# EAGLE design Arduino_MEGA_home_HVAC v2.0 (EAGLE 7.1.0)
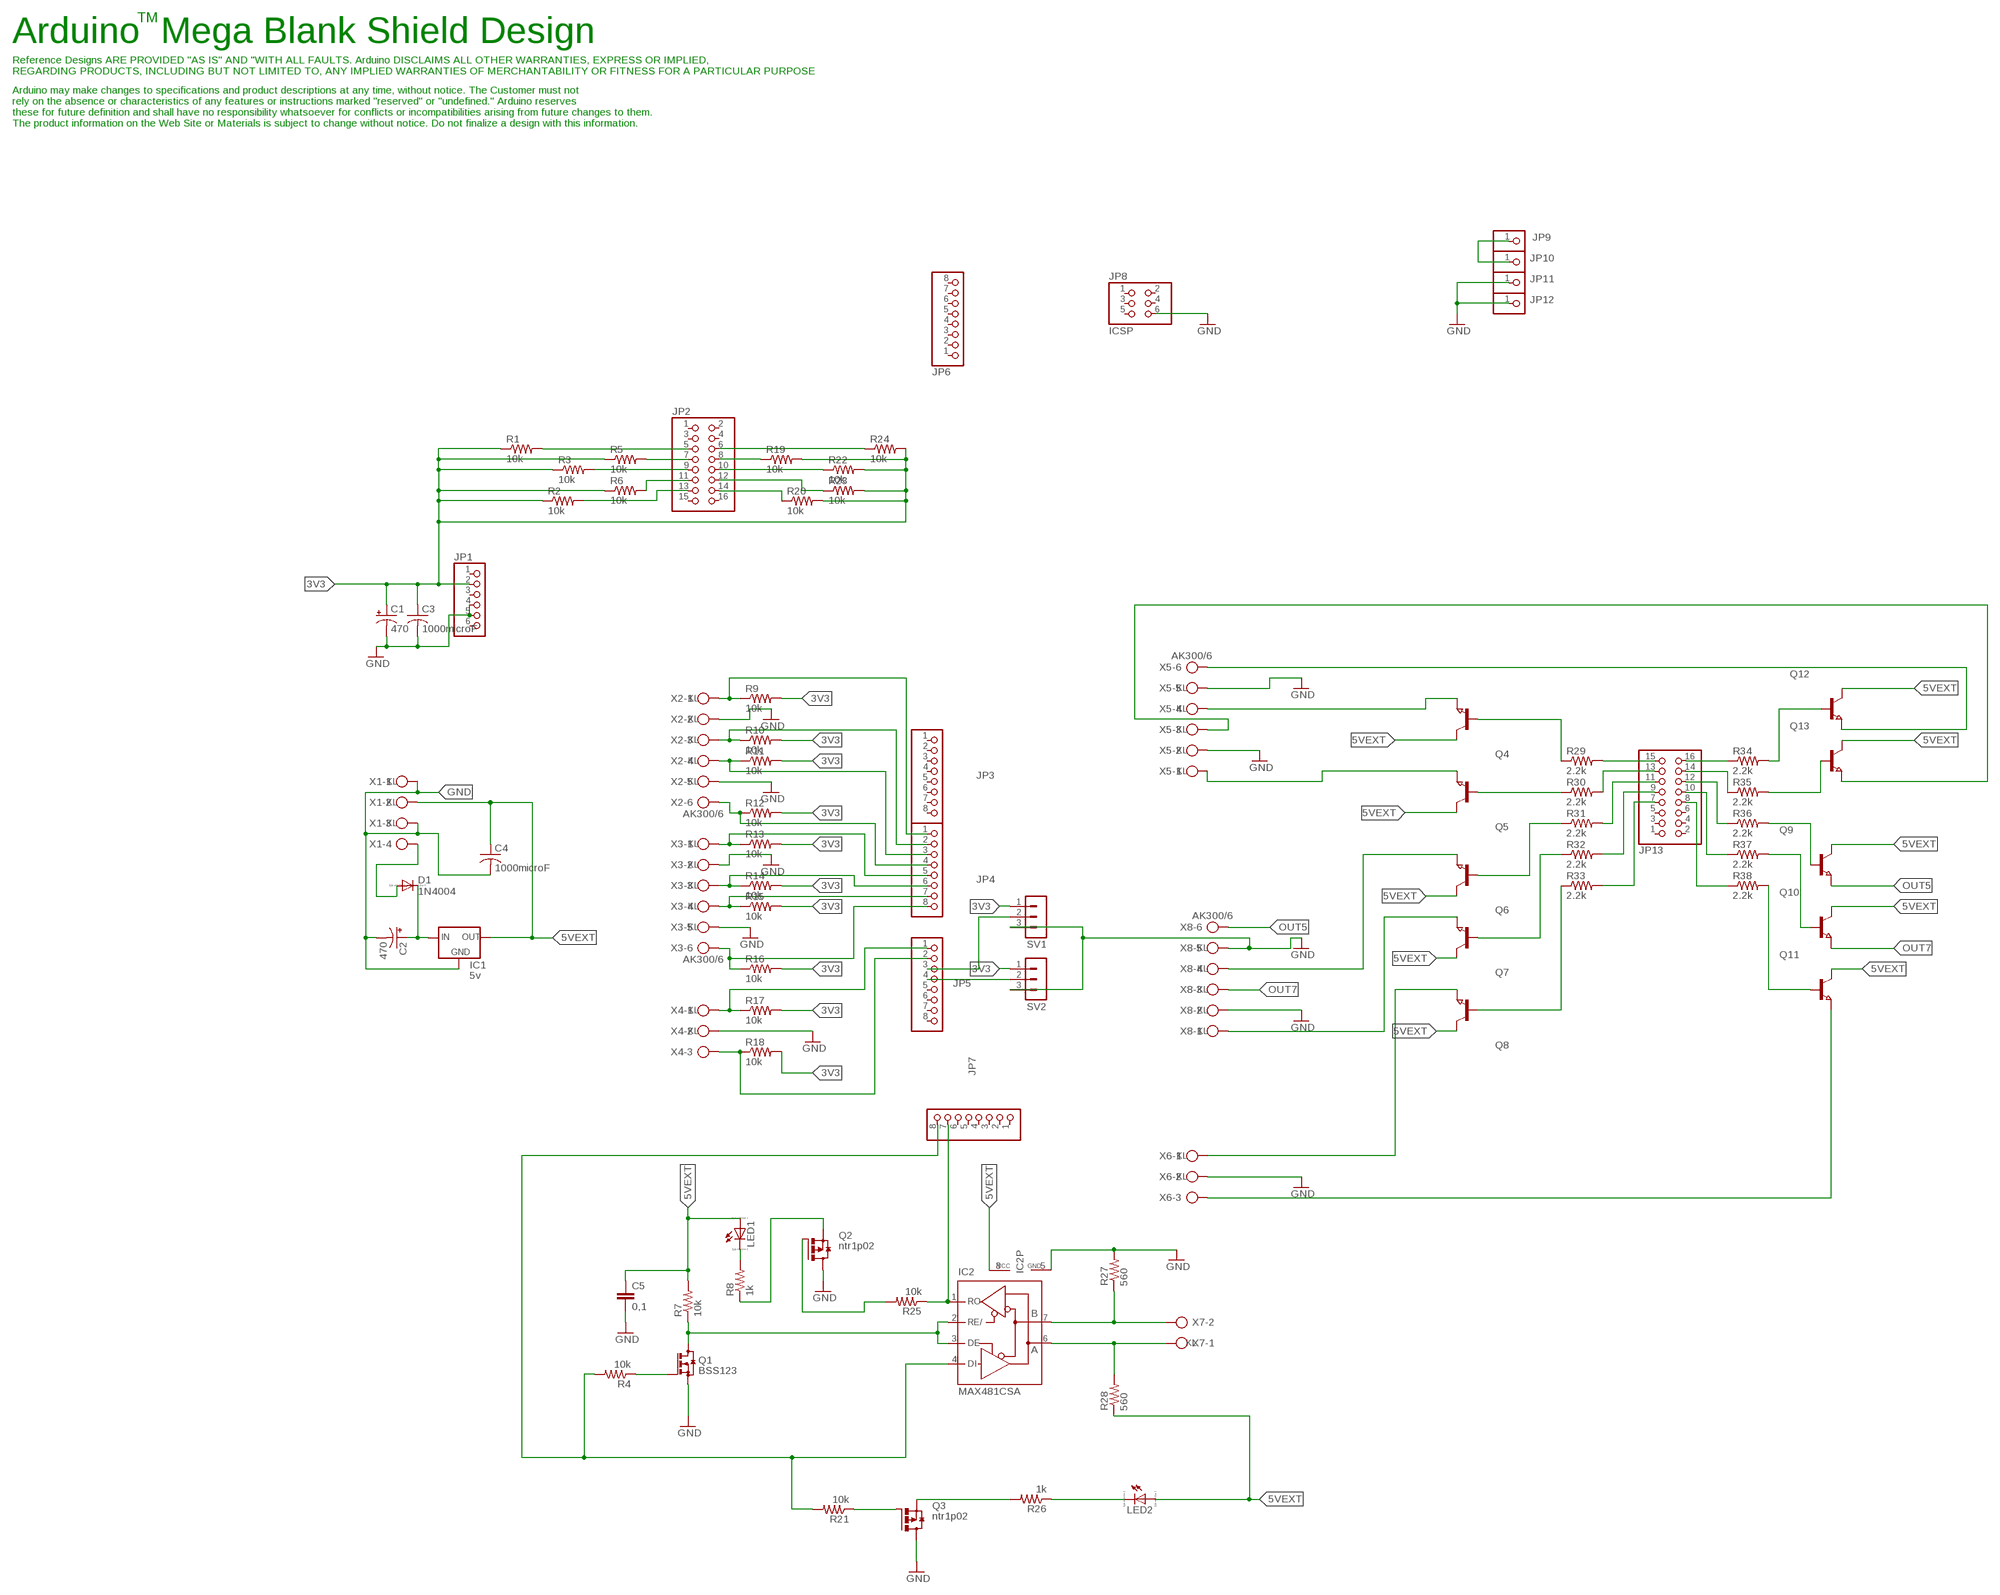
[diagram p0: schematic, sheet 1]

## Parts
C1  470  CPOL-USE5-6  [E5-6]
C2  470  CPOL-USE5-6  [E5-6]
C3  1000microF  C-US025-040X050  [C025-040X050]
C4  1000microF  C-US025-040X050  [C025-040X050]
C5  0,1  C2.5/2  [C2.5-2]
D1  1N4004  [DO41-10]
IC1  5v  78MXXL  [78MXXL]
IC2  MAX481CSA  [SO08]
JP1  PINHD-1X6  [1X06]
JP2  PINHD-2X8  [2X08]
JP3  PINHD-1X8  [1X08]
JP4  PINHD-1X8  [1X08]
JP5  PINHD-1X8  [1X08]
JP6  PINHD-1X8  [1X08]
JP7  PINHD-1X8  [1X08]
JP8  ICSP  PINHD-2X3  [2X03]
JP9  PINHD-1X1  [1X01]
JP10  PINHD-1X1  [1X01]
JP11  PINHD-1X1  [1X01]
JP12  PINHD-1X1  [1X01]
JP13  PINHD-2X8  [2X08]
LED1  LED_E  [LED_1206]
LED2  LED_E  [LED_1206]
Q1  BSS123  [SOT23]
Q2  ntr1p02  FDN360P  [SUPER-SOT3]
Q3  ntr1p02  FDN360P  [SUPER-SOT3]
Q4  NPN-TRANSISTOR_SOT23  [SOT23]
Q5  NPN-TRANSISTOR_SOT23  [SOT23]
Q6  NPN-TRANSISTOR_SOT23  [SOT23]
Q7  NPN-TRANSISTOR_SOT23  [SOT23]
Q8  NPN-TRANSISTOR_SOT23  [SOT23]
Q9  NPN-TRANSISTOR_SOT23  [SOT23]
Q10  NPN-TRANSISTOR_SOT23  [SOT23]
Q11  NPN-TRANSISTOR_SOT23  [SOT23]
Q12  NPN-TRANSISTOR_SOT23  [SOT23]
Q13  NPN-TRANSISTOR_SOT23  [SOT23]
R1  10k  R-US_R0805  [R0805]
R2  10k  R-US_R0805  [R0805]
R3  10k  R-US_R0805  [R0805]
R4  10k  R-US_R0805  [R0805]
R5  10k  R-US_R0805  [R0805]
R6  10k  R-US_R0805  [R0805]
R7  10k  R-US_R0805  [R0805]
R8  1k  R-US_R0805  [R0805]
R9  10k  R-US_R0805  [R0805]
R10  10k  R-US_R0805  [R0805]
R11  10k  R-US_R0805  [R0805]
R12  10k  R-US_R0805  [R0805]
R13  10k  R-US_R0805  [R0805]
R14  10k  R-US_R0805  [R0805]
R15  10k  R-US_R0805  [R0805]
R16  10k  R-US_R0805  [R0805]
R17  10k  R-US_R0805  [R0805]
R18  10k  R-US_R0805  [R0805]
R19  10k  R-US_R0805  [R0805]
R20  10k  R-US_R0805  [R0805]
R21  10k  R-US_R0805  [R0805]
R22  10k  R-US_R0805  [R0805]
R23  10k  R-US_R0805  [R0805]
R24  10k  R-US_R0805  [R0805]
R25  10k  R-US_R0805  [R0805]
R26  1k  R-US_R0805  [R0805]
R27  560  R-US_R0805  [R0805]
R28  560  R-US_R0805  [R0805]
R29  2.2k  R-US_M0805  [M0805]
R30  2.2k  R-US_M0805  [M0805]
R31  2.2k  R-US_M0805  [M0805]
R32  2.2k  R-US_M0805  [M0805]
R33  2.2k  R-US_M0805  [M0805]
R34  2.2k  R-US_M0805  [M0805]
R35  2.2k  R-US_M0805  [M0805]
R36  2.2k  R-US_M0805  [M0805]
R37  2.2k  R-US_M0805  [M0805]
R38  2.2k  R-US_M0805  [M0805]
SV1  MA03-1  [MA03-1]
SV2  MA03-1  [MA03-1]
X1  AK500/4  [AK500/4]
X2  AK300/6  [AK300/6]
X3  AK300/6  [AK300/6]
X4  AK300/3  [AK300/3]
X5  AK300/6  [AK300/6]
X6  AK300/3  [AK300/3]
X7  AK300/2  [AK300/2]
X8  AK300/6  [AK300/6]

## Nets
3V3: C1.+ C3.1 JP1.2 R1.1 R2.1 R3.1 R5.1 R6.1 R9.2 R10.2 R11.2 R12.2 R13.2 R14.2 R15.2 R16.2 R17.2 R18.2 R19.2 R20.2 R22.2 R23.2 R24.2 SV1.1 SV2.1
5VEXT: C4.1 C5.1 IC1.OUT IC2.8(VCC) LED1.A LED2.A Q4.3(C) Q5.3(C) Q6.3(C) Q7.3(C) Q8.3(C) Q9.3(C) Q10.3(C) Q11.3(C) Q12.3(C) Q13.3(C) R7.2 R28.1 X1.2
COM3RX: IC2.1(RO) JP7.7 R25.1
COM3TX: IC2.4(DI) JP7.8 R4.2 R21.2
GND: C1.- C2.- C3.2 C4.2 C5.2 IC1.GND IC2.5(GND) JP1.4 JP1.5 JP8.6 JP11.1 JP12.1 Q1.2(S) Q2.3(D) Q3.3(D) R27.2 SV1.3 SV2.3 X1.1 X1.3 X2.2 X2.5 X3.2 X3.5 X4.2 X5.2 X5.5 X6.2 X8.2 X8.5
N$1: JP4.8 R16.1 X3.6
N$2: JP4.7 R15.1 X3.4
N$3: JP4.6 R14.1 X3.3
N$4: JP4.5 R13.1 X3.1
N$5: JP4.1 R9.1 X2.1
N$6: JP5.1 R17.1 X4.1
N$7: JP4.3 R11.1 X2.4
N$8: JP4.4 R12.1 X2.6
N$9: JP5.2 R18.1 X4.3
N$10: JP4.2 R10.1 X2.3
N$11: JP13.15 R29.2
N$12: JP13.16 R34.1
N$13: JP13.14 R35.1
N$14: JP13.12 R36.1
N$15: JP13.10 R37.1
N$16: JP13.13 R30.2
N$17: JP13.11 R31.2
N$18: JP13.9 R32.2
N$19: JP13.8 R38.1
N$20: JP13.7 R33.2
N$21: Q4.1(B) R29.1
N$22: Q12.1(B) R34.2
N$23: Q5.1(B) R30.1
N$24: Q13.1(B) R35.2
N$25: Q4.2(E) X5.4
N$26: Q5.2(E) X5.1
N$27: Q13.2(E) X5.3
N$28: Q6.1(B) R31.1
N$29: Q6.2(E) X8.4
N$30: Q9.1(B) R36.2
N$31: Q7.1(B) R32.1
N$32: Q10.1(B) R37.2
N$33: Q8.2(E) X6.1
N$34: Q11.2(E) X6.3
N$35: Q7.2(E) X8.1
N$36: JP9.1 JP10.1
N$37: Q11.1(B) R38.2
N$38: Q8.1(B) R33.1
N$39: Q12.2(E) X5.6
N$40: JP2.12 R23.1
N$41: D1.A X1.4
N$42: C2.+ D1.C IC1.IN
N$43: JP5.3 SV1.2
N$44: JP5.4 SV2.2
N$45: IC2.2(RE/) IC2.3(DE) Q1.3(D) R7.1
N$46: LED1.C R8.2
N$47: Q1.1(G) R4.1
N$48: Q2.2(S) R8.1
N$49: JP2.14 R20.1
N$50: JP2.11 R6.2
N$51: JP2.13 R2.2
N$52: IC2.7(B) R27.1 X7.2
N$53: JP2.6 R24.1
N$54: JP2.5 R1.2
N$55: JP2.7 R5.2
N$56: JP2.8 R19.1
N$57: JP2.10 R22.1
N$58: JP2.9 R3.2
N$59: IC2.6(A) R28.2 X7.1
N$60: Q2.1(G) R25.2
N$61: Q3.1(G) R21.1
N$62: Q3.2(S) R26.2
N$63: LED2.C R26.1
OUT5: Q9.2(E) X8.6
OUT7: Q10.2(E) X8.3
Unconnected: JP1.1 JP1.3 JP1.6 JP2.1 JP2.2 JP2.3 JP2.4 JP2.15 JP2.16 JP3.1 JP3.2 JP3.3 JP3.4 JP3.5 JP3.6 JP3.7 JP3.8 JP5.5 JP5.6 JP5.7 JP5.8 JP6.1 JP6.2 JP6.3 JP6.4 JP6.5 JP6.6 JP6.7 JP6.8 JP7.1 JP7.2 JP7.3 JP7.4 JP7.5 JP7.6 JP8.1 JP8.2 JP8.3 JP8.4 JP8.5 JP13.1 JP13.2 JP13.3 JP13.4 JP13.5 JP13.6

## Notes on the sheet
- TM
- Arduino  Mega Blank Shield Design
- Reference Designs ARE PROVIDED "AS IS" AND "WITH ALL FAULTS. Arduino DISCLAIMS ALL OTHER WARRANTIES, EXPRESS OR IMPLIED,
  REGARDING PRODUCTS, INCLUDING BUT NOT LIMITED TO, ANY IMPLIED WARRANTIES OF MERCHANTABILITY OR FITNESS FOR A PARTICULAR PURPOSE
- Arduino may make changes to specifications and product descriptions at any time, without notice. The Customer must not
  rely on the absence or characteristics of any features or instructions marked "reserved" or "undefined." Arduino reserves
  these for future definition and shall have no responsibility whatsoever for conflicts or incompatibilities arising from future changes to them.
  The product information on the Web Site or Materials is subject to change without notice. Do not finalize a design with this information.

## Library data of the parts
C1 C2 = rcl:CPOL-US: POLARIZED CAPACITOR, American symbol
C3 C4 = rcl:C-US: CAPACITOR, American symbol
C5 = capacitor-wima:C: CAPACITOR naming: grid - package width
D1 = diode:1N4004: DIODE general purpose rectifier, 1 A
IC1 = v-reg:78MXXL: VOLTAGE REGULATOR
IC2 = maxim:MAX481CSA: RS485 TRANSEIVER; MF: MAXIM; MPN: MAX481CSA; OC_FARNELL: unknown; OC_NEWARK: 90C3817
JP1 = pinhead:PINHD-1X6: PIN HEADER
JP2 JP13 = pinhead:PINHD-2X8: PIN HEADER
JP3-JP7 = pinhead:PINHD-1X8: PIN HEADER
JP8 = pinhead:PINHD-2X3: PIN HEADER
JP9-JP12 = pinhead:PINHD-1X1: PIN HEADER
LED1 LED2 = eagle-ltspice:LED_E: LED Source: http://www.osram.convergy.de Source: www.luxeon.com Source: www.kingbright.com; SPICEMODEL: NONE; SPICEPREFIX: D; SPICETYPE: diode
Q1 = transistor-small-signal:BSS123: N-CHANNEL MOS FET
Q2 Q3 = transistor-power:FDN360P: Single P-Channel, PowerTrench (R) MOSFET Source: http://www.fairchildsemi.com/ds/FD/FDN360P.pdf
Q4-Q13 = semicon-smd-ipc:NPN-TRANSISTOR_: NPN TRANSISTOR
R1-R38 = resistor:R-US_: RESISTOR, American symbol
SV1 SV2 = con-lstb:MA03-1: PIN HEADER; OC_FARNELL: unknown; OC_NEWARK: unknown
X1 = con-ptr500:AK500/4: CONNECTOR; OC_FARNELL: unknown; OC_NEWARK: unknown
X2 X3 X5 X8 = con-ptr500:AK300/6: CONNECTOR; OC_FARNELL: unknown; OC_NEWARK: unknown
X4 X6 = con-ptr500:AK300/3: CONNECTOR; OC_FARNELL: unknown; OC_NEWARK: unknown
X7 = con-ptr500:AK300/2: CONNECTOR; OC_FARNELL: unknown; OC_NEWARK: unknown

## Net classes
0 default: width 0.152 mm, drill 0.305 mm, clearance 0.152 mm

## Board
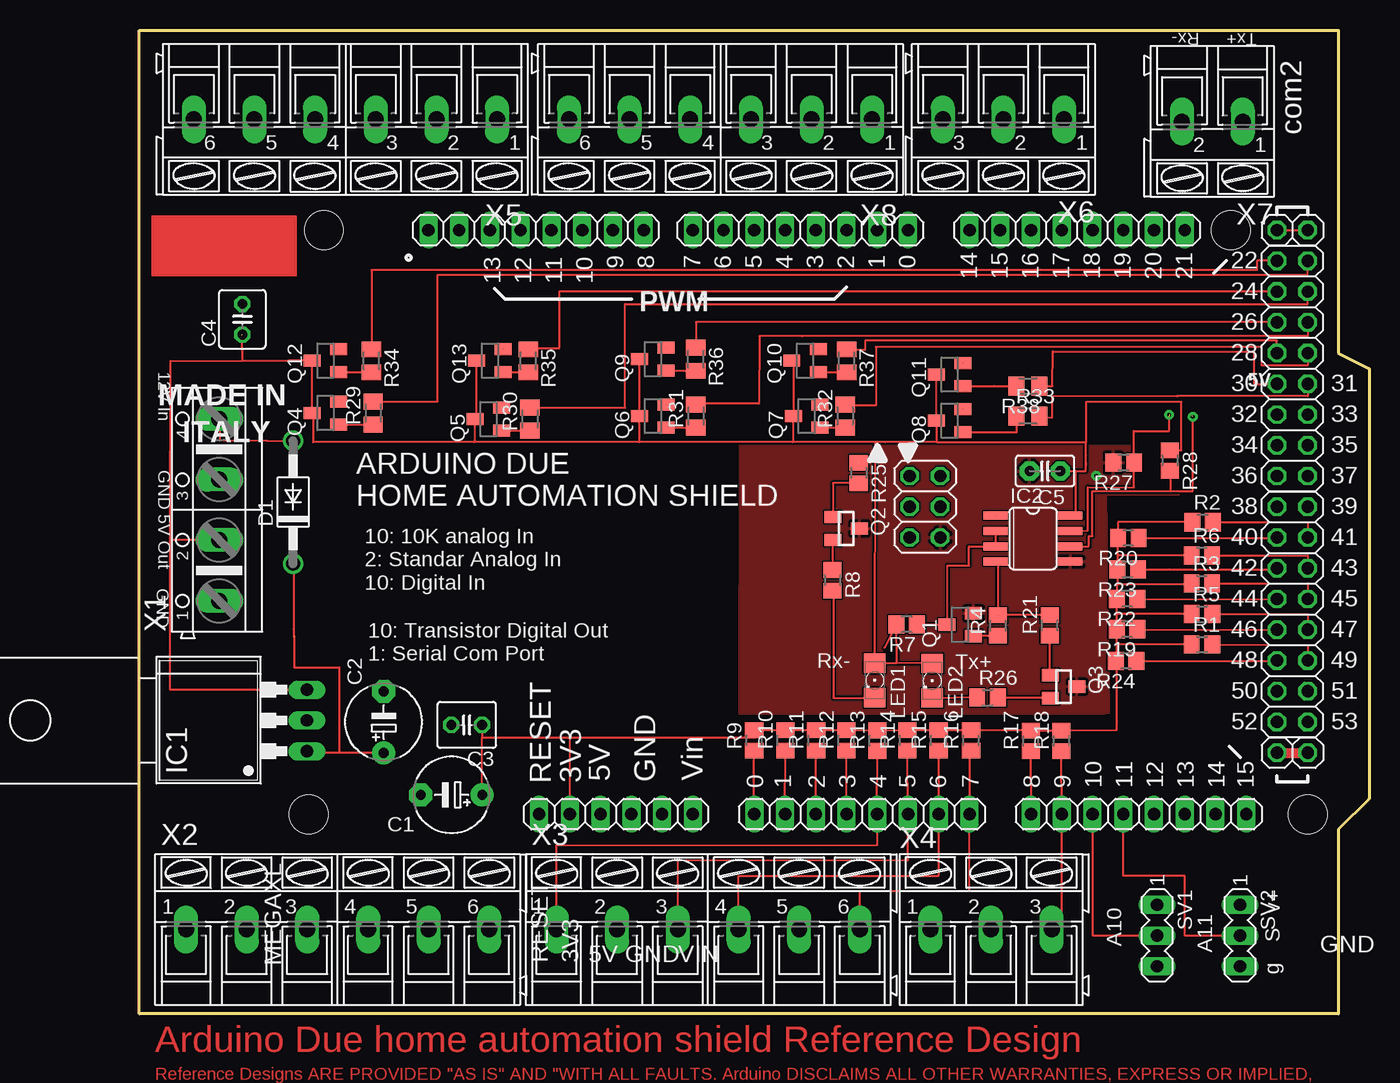
[diagram p1: board, top side]
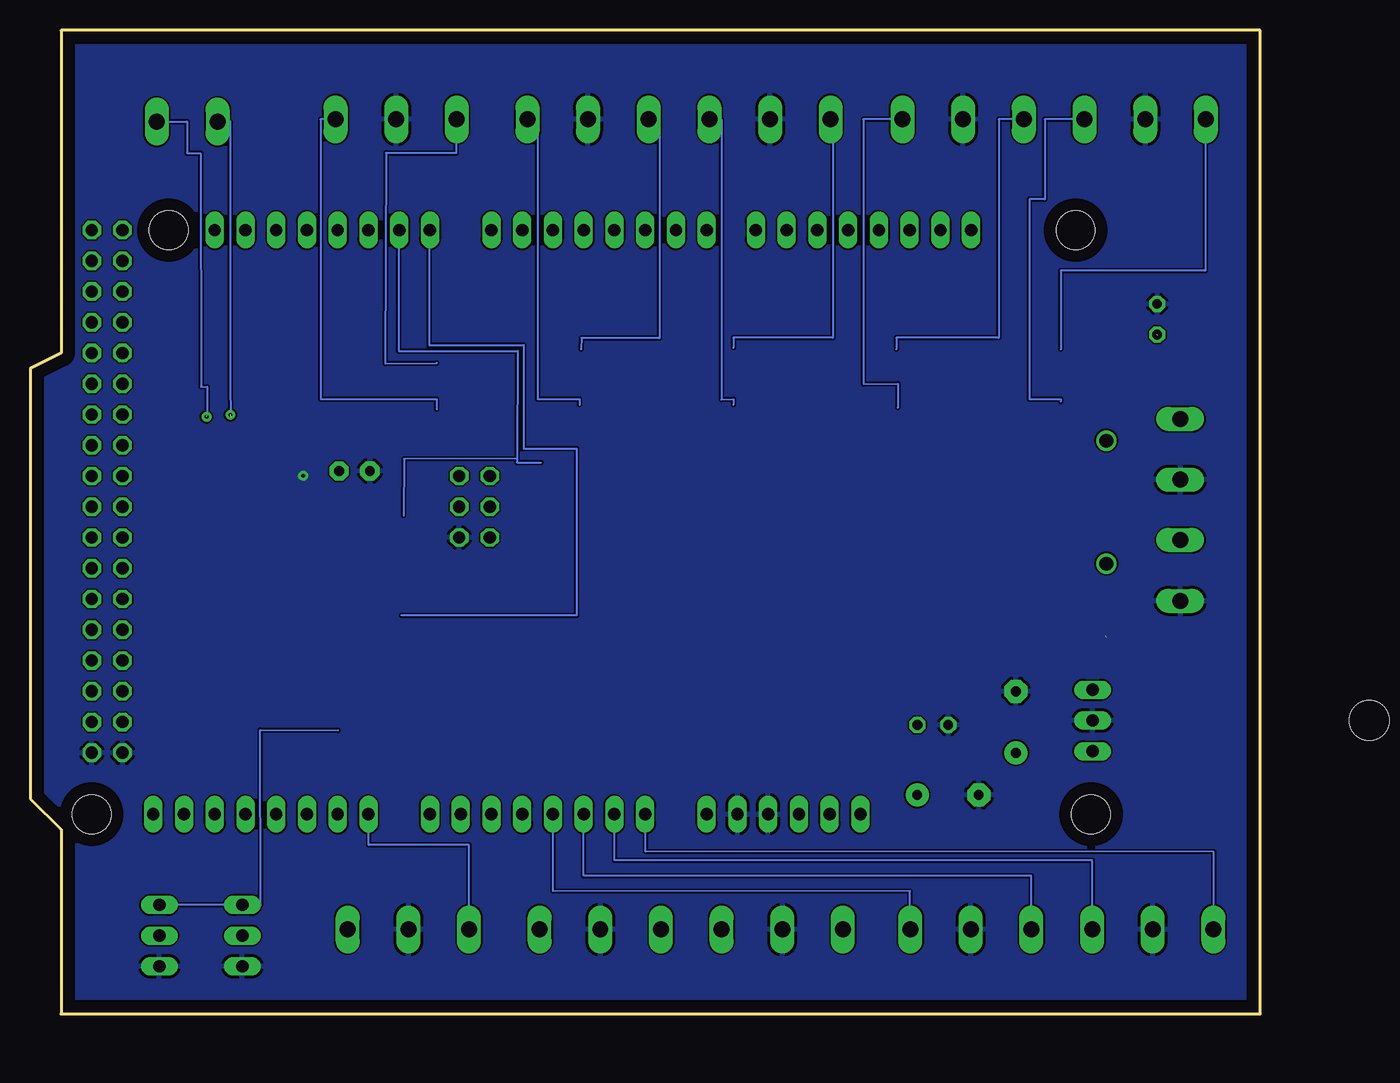
[diagram p2: board, bottom side, seen from below]

Size 101.6 x 81.28 mm. Coordinates in mm from the lower left corner, seen from the top.
Outline: 0,81.28 99.06,81.28 99.06,54.61 101.6,53.34 101.6,17.78 99.06,15.24 99.06,0 0,0 0,81.28
Copper layers (1*16): Top 0.035mm / dielectric 1.5mm / Bottom 0.035mm
Design rules "default": minimum track width 6mil, minimum drill 12mil, track to track 6mil, track to pad 6mil, pad to pad 6mil, via to via 6mil, smd to smd 6mil, copper to edge 40mil, drill to drill 12mil, minimum pad ring 10mil, minimum via ring 10mil, stop-mask expansion 2mil, vias tented up to drill 1mil, thermal gap 10mil
Holes 3.2 mm at 96.52,16.51 15.24,64.77 90.17,64.77 13.97,16.51

### Footprints (pad centres in the part's own frame; a part is rotated, then mirrored left to right if it is on the bottom)
E5-6 = drill 0.813 pad 1.905: + -2.54,0 | drill 0.813 pad 1.905 octagon: - 2.54,0
C025-040X050 = drill 0.813 octagon: 1 -1.27,0; 2 1.27,0
C2.5-2 = drill 0.813 pad 1.6 octagon: 1 -1.27,0; 2 1.27,0
DO41-10 = drill 1.118: A 5.08,0; C -5.08,0
78MXXL = drill 1.016 long: GND 0,-5.08; IN -2.54,-5.08; OUT 2.54,-5.08 | hole 3.302: 0,17.78
SO08 = smd 0.66 x 2.032: 1 -1.905,-3.073; 2 -0.635,-3.073; 3 0.635,-3.073; 4 1.905,-3.073; 5 1.905,3.073; 6 0.635,3.073; 7 -0.635,3.073; 8 -1.905,3.073
1X06 = drill 1.016 long: 1 -6.35,0; 2 -3.81,0; 3 -1.27,0; 4 1.27,0; 5 3.81,0; 6 6.35,0
2X08 = drill 1.016 octagon: 1 -8.89,-1.27; 2 -8.89,1.27; 3 -6.35,-1.27; 4 -6.35,1.27; 5 -3.81,-1.27; 6 -3.81,1.27; 7 -1.27,-1.27; 8 -1.27,1.27; 9 1.27,-1.27; 10 1.27,1.27; 11 3.81,-1.27; 12 3.81,1.27; 13 6.35,-1.27; 14 6.35,1.27; 15 8.89,-1.27; 16 8.89,1.27
1X08 = drill 1.016 long: 1 -8.89,0; 2 -6.35,0; 3 -3.81,0; 4 -1.27,0; 5 1.27,0; 6 3.81,0; 7 6.35,0; 8 8.89,0
2X03 = drill 1.016 octagon: 1 -2.54,-1.27; 2 -2.54,1.27; 3 0,-1.27; 4 0,1.27; 5 2.54,-1.27; 6 2.54,1.27
1X01 = drill 1.016 octagon: 1 0,0
LED_1206 = smd 1.6 x 1.803: A -1.422,0; C 1.422,0
SOT23 = smd 1 x 1.4: 1 -0.95,-1.1; 2 0.95,-1.1; 3 0,1.1
SUPER-SOT3 = smd 1 x 1.4: 1 -0.95,-1.1; 2 0.95,-1.1; 3 0,1.1
R0805 = smd 1.3 x 1.5: 1 -0.85,0; 2 0.85,0
M0805 = smd 1.3 x 1.6: 1 -0.95,0; 2 0.95,0
MA03-1 = drill 1.016 long: 1 -2.54,0; 2 0,0; 3 2.54,0
AK500/4 = drill 1.321 long: 1 -7.518,0; 2 -2.489,0; 3 2.489,0; 4 7.518,0
AK300/6 = drill 1.321 long: 1 -12.522,0; 2 -7.518,0; 3 -2.515,0; 4 2.515,0; 5 7.518,0; 6 12.522,0
AK300/3 = drill 1.321 long: 1 -5.004,0; 2 0,0; 3 5.004,0
AK300/2 = drill 1.321 long: 1 -2.515,0; 2 2.489,0

### Placement (x,y rotation side)
C1  25.78,18.1 180 top
C2  20.18,24.13 90 top
C3  27.04,23.88 180 top
C4  8.51,57.4 90 top
C5  74.81,44.87 180 top
D1  12.7,42.29 90 top
IC1  8.76,24.26 90 top
IC2  73.82,39.28 270 top
JP1  39.37,16.51 0 top
JP2  95.25,33.02 90 top
JP3  54.61,64.77 180 top
JP4  59.69,16.51 0 top
JP5  82.55,16.51 0 top
JP6  32.77,64.77 180 top
JP7  77.47,64.77 180 top
JP8  64.9,41.91 270 top
JP9  93.98,64.77 0 top
JP10  96.52,64.77 0 top
JP11  93.98,21.59 0 top
JP12  96.52,21.59 0 top
JP13  95.25,53.34 90 top
LED1  60.74,27.57 270 top
LED2  65.49,27.54 270 top
Q1  67.8,32.17 90 top
Q2  58.39,40.12 270 top
Q3  76.36,27.05 270 top
Q4  15.37,49.66 90 top
Q5  28.83,49.15 90 top
Q6  42.42,49.4 90 top
Q7  55.12,49.4 90 top
Q8  66.93,49.02 90 top
Q9  42.42,54.1 90 top
Q10  54.99,53.98 90 top
Q11  66.93,52.83 90 top
Q12  15.37,53.98 90 top
Q13  28.96,53.98 90 top
R1  87.78,30.53 0 top
R2  87.83,40.63 0 top
R3  87.77,35.57 0 top
R4  70.93,32.1 90 top
R5  87.78,33.04 0 top
R6  87.77,37.9 0 top
R7  63.39,32.19 180 top
R8  57.26,35.83 270 top
R9  50.79,22.61 90 top
R10  53.36,22.61 90 top
R11  55.91,22.61 90 top
R12  58.41,22.61 90 top
R13  60.96,22.59 90 top
R14  63.46,22.61 90 top
R15  66.03,22.61 90 top
R16  68.71,22.61 90 top
R17  73.65,22.57 90 top
R18  76.18,22.57 90 top
R19  81.59,31.79 180 top
R20  81.7,39.33 180 top
R21  75.21,32.11 90 top
R22  81.6,34.3 180 top
R23  81.65,36.72 180 top
R24  81.51,29.17 180 top
R25  59.42,44.7 270 top
R26  70.07,26.15 0 top
R27  81.32,45.56 180 top
R28  85.13,45.73 270 top
R29  19.3,49.66 90 top
R30  32.26,49.15 90 top
R31  45.97,49.4 90 top
R32  58.29,49.4 90 top
R33  73.41,49.4 0 top
R34  19.18,53.98 270 top
R35  32.13,53.98 270 top
R36  45.97,54.1 270 top
R37  58.42,53.98 270 top
R38  73.41,51.89 180 top
SV1  84.07,6.48 270 top
SV2  90.93,6.48 270 top
X1  6.6,41.66 90 top
X2  16.38,6.99 0 top
X3  46.99,6.99 0 top
X4  70.36,6.99 0 top
X5  17.02,73.91 180 top
X6  71.37,73.91 180 top
X7  88.62,73.74 180 top
X8  48.01,73.91 180 top

### Tracks (layer width: path | path; a pad name or v marks a point on that pad's centre or on a via)
3V3  (1 unrouted)
  Top 0.152: JP1.2 35.56,22.85 | 80.75,29.26 80.75,24.18 80.74,23.45 R18.2 75.52,23.42 R17.2 73.75,23.45 68.55,23.45 68.58,23.46 R16.2 R15.2 R14.2 R13.2 R12.2 R11.2 R10.2 R9.2 50.93,22.86 35.56,22.86 35.56,22.85 | 80.75,29.26 80.75,30.53 | 80.75,30.53 R19.2 | R19.2 80.75,33.07 | 80.75,33.07 R22.2 80.81,34.3 80.78,35.54 | 80.78,35.54 86.92,35.54 R3.1 | R5.1 80.75,33.07 | R1.1 80.75,30.53 | R24.2 80.75,29.26 | R19.2 | 28.29,23.88 C3.1 28.32,23.39 28.32,22.85 | 28.32,22.85 35.56,22.85 | 28.32,22.85 28.29,22.85 | 80.8,37.9 80.8,39.05 R20.2 80.84,40.64 R2.1 | 80.8,37.9 R23.2 80.81,37.08 80.78,35.54 | R6.1 80.8,37.9 | C1.+ 28.32,22.85
  Bottom 0.152: 76.18,23.44 82.59,23.46 82.55,9.02 SV1.1 SV2.1
5VEXT  (1 unrouted)
  Top 0.152: 27.69,47.24 27.69,49.15 Q5.3 27.86,49.15 Q13.3 | 27.69,47.24 14.35,47.24 14.35,49.66 Q4.3 | 41.27,47.24 41.27,49.4 Q6.3 Q9.3 | 41.27,47.24 27.69,47.24 | 53.98,47.24 53.98,49.4 Q7.3 54.02,53.98 Q10.3 | 53.98,47.24 41.27,47.24 | 65.84,47.24 Q8.3 Q11.3 | 65.84,47.24 61.59,47.24 60.74,47.24 | 60.74,47.24 53.98,47.24 | Q4.3 Q12.3 12.32,53.98 12.35,53.96 8.51,53.95 8.51,56.1 8.51,53.98 2.57,53.96 2.54,39.17 | 2.54,39.17 2.54,26.8 IC1.OUT | 14.27,49.53 Q4.3 | X1.2 2.54,39.17 | 78.19,45.34 78.18,44.87 77.35,44.87 | 78.19,45.34 78.19,46.15 78.19,47.24 | 65.84,47.24 78.19,47.24 | LED2.A 62.56,29 62.56,29.11 | 62.56,29.11 R7.2 61.54,30.26 | 60.74,47.24 LED1.A 62.56,28.99 62.56,29.11 | C5.1 77.35,44.87 | 78.19,45.56 78.19,45.34 | R28.1 86.08,46.58 86.08,50.58 78.19,50.58 78.19,47.24 | IC2.8 77.35,41.18 77.35,44.87
COM3RX  (2 unrouted)
  Bottom 0.152: JP7.7 71.17,64.77 71.17,54.78 61.33,54.78 61.39,45.9 | 61.39,45.9 61.39,45.58 R25.1 | 61.39,45.9 70.73,45.86 IC2.1
COM3TX  (1 unrouted)
  Top 0.152: R21.2 R4.2 70.93,37.37 IC2.4
  Bottom 0.152: JP7.8 68.63,64.77 68.63,55.28 60.84,55.28 60.84,46.7 56.45,46.7 56.45,32.94 R4.2
GND  (via drill 0.3)
  Top 0.152: 66.17,39.33 JP8.6
  Top 0.813: JP11.1 JP12.1
  other vias: 79.06,44.47
  pour Bottom: -0.25,81.41 -0.25,-0.38 101.85,-0.51 101.85,81.41
  pour Top: 49.57,46.1 49.55,24.83 79.79,24.83 80.13,24.91 79.87,42.92 85.87,42.92 85.87,46.95 49.57,46.94 49.58,46.35
N$1
  Top 0.152: R16.1 68.58,21.76 JP4.8 68.58,10.16 59.52,10.16 59.52,6.99 X3.6
N$2
  Top 0.152: X3.4 49.51,6.96 49.49,11.4 66.04,11.43 JP4.7 66.03,16.47 R15.1
N$3
  Top 0.152: R14.1 JP4.6 63.5,12.7 44.49,12.73 X3.3
N$4
  Top 0.152: R13.1 60.94,16.55 JP4.5 60.96,13.97 34.45,13.94 34.47,7.02 X3.1
N$5
  Top 0.152: JP4.1 R9.1
  Bottom 0.152: X2.1 3.83,6.97 3.83,13.39 50.77,13.43 JP4.1
N$6
  Top 0.152: JP5.1 73.69,16.54 R17.1
  Bottom 0.152: X4.1 65.34,6.96 65.36,13.97 73.66,13.97 JP5.1
N$7
  Top 0.152: JP4.3 55.91,16.53 R11.1
  Bottom 0.152: X2.4 18.9,11.43 55.88,11.43 JP4.3
N$8
  Top 0.152: JP4.4 58.42,21.59 58.42,21.65 R12.1
  Bottom 0.152: X2.6 28.92,7.03 28.92,10.15 58.42,10.16 JP4.4
N$9
  Top 0.152: R18.1 76.21,16.48 JP5.2 76.2,6.99 X4.3
N$10
  Top 0.152: JP4.2 53.34,16.53 R10.1
  Bottom 0.152: X2.3 13.86,6.99 13.88,12.68 53.34,12.7 JP4.2
N$11
  Top 0.152: R29.2 24.64,50.61 24.64,61.09 96.52,61.09 JP13.15
N$12
  Top 0.152: JP13.16 92.33,62.23 92.33,61.47 19.18,61.47 R34.1
N$13
  Top 0.152: JP13.14 34.67,59.69 34.67,54.99 32.13,54.99 R35.1
N$14
  Top 0.152: JP13.12 45.97,57.15 R36.1
N$15
  Top 0.152: R37.1 58.42,54.86 59.94,54.86 59.94,55.26 59.94,55.63 93.98,55.63 JP13.10
N$16
  Top 0.152: R30.2 40.13,50.1 40.13,58.67 96.52,58.67 JP13.13
N$17
  Top 0.152: JP13.11 96.52,56.01 54.74,56.01 54.78,56.01 51.22,56.01 51.18,50.42 45.97,50.42 R31.2
N$18
  Top 0.152: JP13.9 96.52,53.59 92.71,53.59 92.71,55.12 60.83,55.12 60.83,50.29 58.29,50.29 R32.2
N$19
  Top 0.152: R38.1 75.44,51.89 75.45,54.74 92.08,54.74 92.08,52.06 93.98,52.06 JP13.8
N$20
  Top 0.152: JP13.7 96.52,51.04 85.77,51.05 85.72,51.04 75.36,51.02 75.36,49.25 74.36,49.28 R33.2
N$21
  Top 0.152: Q4.1 R29.1
N$22
  Top 0.152: Q12.1 R34.2
N$23
  Top 0.152: Q5.1 R30.1
N$24
  Top 0.152: Q13.1 R35.2
N$25  (1 unrouted)
  Top 0.152: Q4.2 16.51,50.61
  Bottom 0.152: X5.4 17.78,73.91 17.78,67.31 19.05,67.31 19.05,50.8 16.47,50.8 Q4.2
N$26  (1 unrouted)
  Bottom 0.152: X5.1 32.77,73.93 32.76,52.06 29.93,52.07 Q5.2
N$27  (1 unrouted)
  Top 0.152: Q13.2 29.97,54.92
  Bottom 0.152: X5.3 21.59,73.91 21.59,55.88 30.06,55.88 Q13.2
N$28
  Top 0.152: Q6.1 R31.1
N$29  (1 unrouted)
  Top 0.152: Q6.2 43.56,50.35
  Bottom 0.152: X8.4 44.51,73.91 44.51,50.75 43.52,50.8 Q6.2
N$30
  Top 0.152: Q9.1 R36.2
N$31
  Top 0.152: Q7.1 R32.1
N$32
  Top 0.152: Q10.1 R37.2
N$33  (1 unrouted)
  Bottom 0.152: X6.1 77.62,73.92 77.6,50.8 68.03,50.8 Q8.2
N$34  (1 unrouted)
  Bottom 0.152: Q11.2 72.27,53.75 72.22,71.15 72.22,71.14 66.42,71.14 66.42,73.91 X6.3
N$35  (1 unrouted)
  Top 0.152: Q7.2 56.26,50.35
  Bottom 0.152: X8.1 59.69,73.91 59.69,50.8 56.22,50.8 Q7.2
N$36
  Top 0.152: JP9.1 JP10.1
N$37
  Top 0.152: Q11.1 70.61,51.88 70.6,51.9 R38.2
N$38
  Top 0.152: Q8.1 72.47,48.08 R33.1
N$39  (1 unrouted)
  Top 0.152: Q12.2 16.18,54.92
  Bottom 0.152: X5.6 4.51,73.89 4.54,61.4 16.47,61.4 Q12.2
N$40
  Top 0.152: R23.1 85.08,36.72 85.11,36.73 93.98,36.73 JP2.12
N$41
  Top 0.152: D1.A 11.87,47.36 10.53,47.37 6.61,47.35 X1.4
N$42  (1 unrouted)
  Top 0.152: 16.51,21.59 16.51,28.65 12.77,28.65 12.77,31.23 | 16.51,21.59 13.84,21.59 IC1.IN | D1.C 12.74,37.21 12.74,31.79 12.75,31.16 | C2.+ 16.51,21.59
N$43
  Top 0.152: JP5.3 78.74,6.49 82.8,6.49 SV1.2
N$44
  Top 0.152: SV2.2 86.36,6.48 86.36,11.43 81.28,11.43 JP5.4
N$45
  Top 0.152: R7.1 65.79,32.2 Q1.3 66.74,32.17 66.74,37.05 68.55,37.05 68.55,38.65 IC2.3 IC2.2
N$46
  Top 0.152: R8.2 57.32,34.98 57.32,26.13 LED1.C
N$47
  Top 0.152: R4.1 68.9,31.25 Q1.1
N$48
  Top 0.152: 57.45,39.17 Q2.2 57.26,39.17 R8.1
N$49
  Top 0.152: R20.1 93.98,39.33 JP2.14
N$50
  Top 0.152: R6.2 96.52,37.9 JP2.11
N$51
  Top 0.152: R2.2 96.51,40.65 JP2.13
N$52  (via drill 0.3)  (1 unrouted)
  Top 0.152: IC2.7 78.34,39.93 78.34,43.54 82.17,43.52 R27.1 82.15,45.56 82.15,48.17 85.07,48.17 v85.07,49.51
  Bottom 0.152: X7.2 85.07,73.74 85.07,52.21 85.08,52.06 85.06,49.31
N$53
  Top 0.152: R24.1 93.98,29.19 JP2.6
N$54
  Top 0.152: R1.2 96.52,30.48 JP2.5
N$55
  Top 0.152: R5.2 96.52,33.05 JP2.7
N$56
  Top 0.152: R19.1 JP2.8
N$57
  Top 0.152: R22.1 93.98,34.26 JP2.10
N$58
  Top 0.152: R3.2 96.52,35.58 JP2.9
N$59  (via drill 0.3)  (1 unrouted)
  Top 0.152: IC2.6 78.42,38.64 78.42,39.48 78.73,39.48 78.73,43.2 85.17,43.2 | v87.03,49.35 87,49.35 87,43.2 85.17,43.2 | R28.2 85.17,44.88 85.17,43.2
  Bottom 0.152: X7.1 88.64,73.74 88.64,71.13 87.52,71.12 87.49,51.83 86.98,51.81 86.99,49.45
N$60
  Top 0.152: R25.2 57.29,43.85 Q2.1
N$61
  Top 0.152: Q3.1 75.21,28 R21.1
N$62
  Top 0.152: R26.2 75.26,26.14 Q3.2
N$63
  Top 0.152: LED2.C 69.22,26.2 R26.1
OUT5  (1 unrouted)
  Bottom 0.152: X8.6 35.31,73.91 35.31,55.88 43.52,55.88 Q9.2
OUT7  (1 unrouted)
  Top 0.152: Q10.2 56.01,54.92
  Bottom 0.152: X8.3 49.63,73.91 49.63,55.83 56.06,55.85 Q10.2
(copper drawn outside any net)
  shapes: Top area x1

### Text on the board
Top: Arduino Due home automation shield Reference Design | Reference Designs ARE PROVIDED "AS IS" AND "WITH ALL FAULTS. Arduino DISCLAIMS ALL OTHER WARRANTIES, EXPRESS OR IMPLIED, / REGARDING PRODUCTS, INCLUDING BUT NOT LIMITED TO, ANY IMPLIED WARRANTIES OF MERCHANTABILITY OR FITNESS FOR A PARTICULAR PURPOSE | Arduino may make changes to specifications and product descriptions at any time, without notice. The Customer must not / rely on the absence or characteristics of any features or instructions marked "reserved" or "undefined." Arduino reserves / these for future definition and shall have no responsibility whatsoever for conflicts or incompatibilities arising from future changes to them. / The product information on the Web Site or Materials is subject to change without notice. Do not finalize a design with this information.
tPlace: Rx- | Tx+ | com2 | 9 | 8 | 7 | 6 | 5 | 4 | 3 | 2 | 1 | 0 | 22 | 14 | 15 | 16 | 17 | 18 | 19 | 20 | 21 | 13 | 12 | 11 | 10 | 24 | 26 | 28 | 12V In | 30 | 31 | 32 | 33 | 34 | 35 | GND | 36 | 37 | ARDUINO DUE / HOME AUTOMATION SHIELD | 5V Out | 38 | 39 | 40 | 41 | 42 | 43 | GND | 44 | 45 | 10: 10K analog In / 2: Standar Analog In / 10: Digital In | 46 | 47 | 10: Transistor Digital Out / 1: Serial Com Port | Rx- | 48 | 49 | Tx+ | 50 | 51 | 52 | 53 | RESET | 3V3 | 5V | GND | Vin | 0 | 1 | 2 | 3 | 4 | 5 | 6 | 7 | 8 | 9 | 10 | 11 | 12 | 13 | 14 | 15 | v+ | A10 | S | A11 | g
tNames: PWM | 5V | MADE IN | ITALY | GND | MEGAXL | RESET | 3V3 | 5V | GND | VIN
ReferenceLC: L | TX | RX | PC1 | PC2